# Altium schematic sheet MB1137.SchDoc: TOP & POWER
size A4; DocumentNumber: MB1137; Revision: B-01; SheetNumber: 1; SheetTotal: 6; Project: NUCLEO-XXXXZX
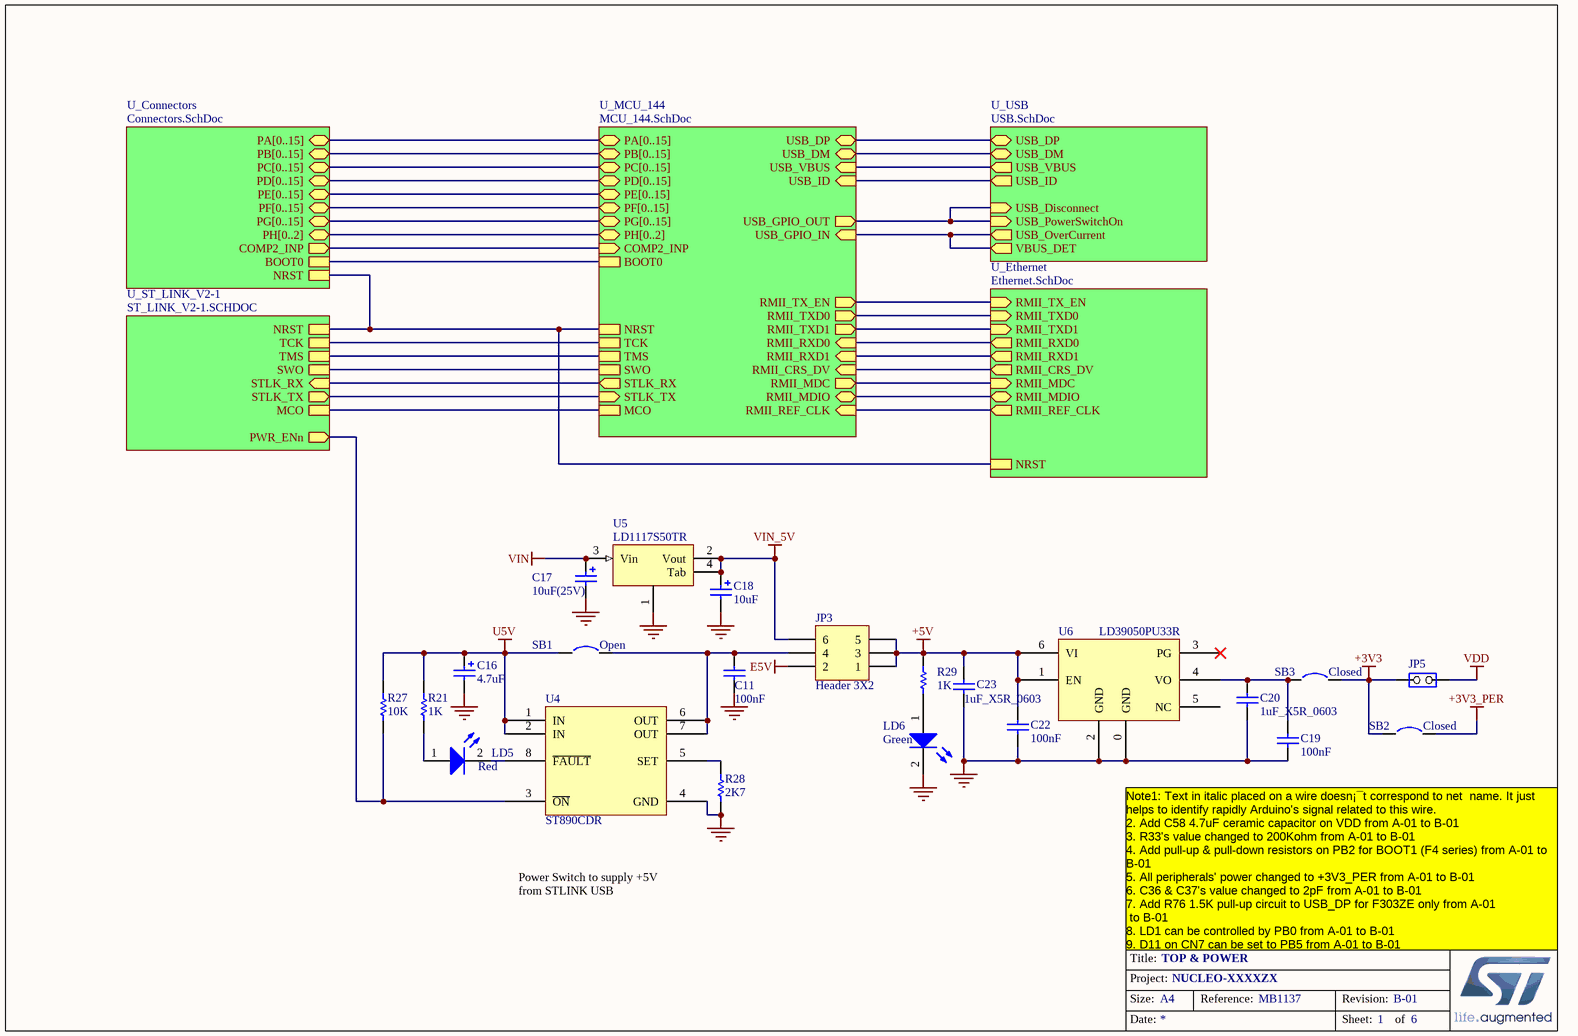
[diagram p0: MB1137.SchDoc]

## Parts
C11  100nF  [0603C]
C16  4.7uF  [TAN-A]
C17  10uF(25V)  [TAN-B]
C18  10uF  [TAN-A]
C19  100nF  [0603C]
C20  1uF_X5R_0603  [0603C]
C22  100nF  [0603C]
C23  1uF_X5R_0603  [0603C]
JP3  Header 3X2  [HDR_3x2_2R54_V_M]
JP5  (no value)  [HDR_1x2_2R54_V_M_S]
LD5  Red  [0603D-R]
LD6  Green  [0603D-G]
R21  1K  [0603R]
R27  10K  [0603R]
R28  2K7  [0603R]
R29  1K  [0603R]
SB1  Open  [SB_0603]
SB2  Closed  [SB_0603]
SB3  Closed  [SB_0603]
U4  ST890CDR  [SOIC8_1R27_4R9X6]
U5  LD1117S50TR  [SOT-223]
U6  LD39050PU33R  [DFN6_0R95_3x3_TP]

## Sub-sheets
U_Connectors = Connectors.SchDoc: PA[0..15] (bidir), PB[0..15] (bidir), PC[0..15] (bidir), NRST, BOOT0, PD[0..15] (bidir), PE[0..15] (bidir), PF[0..15] (bidir), PG[0..15] (bidir), PH[0..2] (bidir), COMP2_INP (out)
U_Ethernet = Ethernet.SchDoc: RMII_TXD0 (in), RMII_TX_EN (in), RMII_RXD0 (out), RMII_REF_CLK (out), RMII_CRS_DV (out), RMII_MDC (in), RMII_MDIO (bidir), NRST, RMII_TXD1 (in), RMII_RXD1 (out)
U_MCU_144 = MCU_144.SchDoc: NRST, MCO, STLK_TX (in), STLK_RX (out), PA[0..15] (bidir), PB[0..15] (bidir), PC[0..15] (bidir), TCK, TMS, SWO, BOOT0, PD[0..15] (bidir), PE[0..15] (bidir), PF[0..15] (bidir), PG[0..15] (bidir), PH[0..2] (bidir), USB_DM (bidir), USB_DP (bidir), USB_GPIO_OUT (out), USB_GPIO_IN (in), USB_ID (in), USB_VBUS (in), RMII_TXD0 (out), RMII_TX_EN (out), RMII_RXD0 (in), RMII_REF_CLK (in), RMII_CRS_DV (in), RMII_MDC (out), RMII_MDIO (bidir), RMII_TXD1 (out), RMII_RXD1 (in), COMP2_INP (in)
U_ST_LINK_V2-1 = ST_LINK_V2-1.SCHDOC: TMS, TCK, MCO, NRST, STLK_RX (in), STLK_TX (out), SWO, PWR_ENn (out)
U_USB = USB.SchDoc: USB_PowerSwitchOn (in), USB_OverCurrent (out), USB_DM (bidir), USB_DP (bidir), USB_ID (out), USB_VBUS (out), USB_Disconnect (in), VBUS_DET (out)

## Nets
+3V3: JP5.1(COMMON) SB2.1 SB3.2
+3V3_PER: SB2.2
+5V: C22.2 C23.1 JP3.1 JP3.3 JP3.5 R29.2 U6.1(EN) U6.6(VI)
E5V: JP3.2
GND: C11.1 C16.2 C17.2 C18.2 C19.1 C20.2 C22.1 C23.2 LD6.2(K) R28.1 U4.4(GND) U5.1 U6.0(GND) U6.2(GND)
U5V: C16.1 R21.1 R27.1 SB1.1 U4.1(IN) U4.2(IN)
VDD: JP5.2(NO)
VIN: C17.1 U5.3(Vin)
VIN_5V: C18.1 JP3.6 U5.2(Vout) U5.4(Tab)
NetC11_2: C11.2 JP3.4 SB1.2 U4.6(OUT) U4.7(OUT)
NetC19_2: C19.2 C20.1 SB3.1 U6.4(VO)
NetLD5_1: LD5.1(A) R21.2
NetLD5_2: LD5.2(K) U4.8(~{FAULT})
NetLD6_1: LD6.1(A) R29.1
NetR27_2: R27.2 U4.3(~{ON}) ; sheet U_ST_LINK_V2-1/PWR_ENn
NetR28_2: R28.2 U4.5(SET)
(unnamed): sheet U_Connectors/NRST, sheet U_ST_LINK_V2-1/NRST, sheet U_Ethernet/NRST, sheet U_MCU_144/NRST
(unnamed): sheet U_Connectors/BOOT0, sheet U_MCU_144/BOOT0
(unnamed): sheet U_Connectors/COMP2_INP, sheet U_MCU_144/COMP2_INP
(unnamed): sheet U_ST_LINK_V2-1/TMS, sheet U_MCU_144/TMS
(unnamed): sheet U_ST_LINK_V2-1/TCK, sheet U_MCU_144/TCK
(unnamed): sheet U_ST_LINK_V2-1/MCO, sheet U_MCU_144/MCO
(unnamed): sheet U_ST_LINK_V2-1/STLK_RX, sheet U_MCU_144/STLK_RX
(unnamed): sheet U_ST_LINK_V2-1/STLK_TX, sheet U_MCU_144/STLK_TX
(unnamed): sheet U_ST_LINK_V2-1/SWO, sheet U_MCU_144/SWO
(unnamed): sheet U_Ethernet/RMII_TXD0, sheet U_MCU_144/RMII_TXD0
(unnamed): sheet U_Ethernet/RMII_TX_EN, sheet U_MCU_144/RMII_TX_EN
(unnamed): sheet U_Ethernet/RMII_RXD0, sheet U_MCU_144/RMII_RXD0
(unnamed): sheet U_Ethernet/RMII_REF_CLK, sheet U_MCU_144/RMII_REF_CLK
(unnamed): sheet U_Ethernet/RMII_CRS_DV, sheet U_MCU_144/RMII_CRS_DV
(unnamed): sheet U_Ethernet/RMII_MDC, sheet U_MCU_144/RMII_MDC
(unnamed): sheet U_Ethernet/RMII_MDIO, sheet U_MCU_144/RMII_MDIO
(unnamed): sheet U_Ethernet/RMII_TXD1, sheet U_MCU_144/RMII_TXD1
(unnamed): sheet U_Ethernet/RMII_RXD1, sheet U_MCU_144/RMII_RXD1
(unnamed): sheet U_MCU_144/USB_DM, sheet U_USB/USB_DM
(unnamed): sheet U_MCU_144/USB_DP, sheet U_USB/USB_DP
(unnamed): sheet U_MCU_144/USB_GPIO_OUT, sheet U_USB/USB_PowerSwitchOn, sheet U_USB/USB_Disconnect
(unnamed): sheet U_MCU_144/USB_GPIO_IN, sheet U_USB/USB_OverCurrent, sheet U_USB/VBUS_DET
(unnamed): sheet U_MCU_144/USB_ID, sheet U_USB/USB_ID
(unnamed): sheet U_MCU_144/USB_VBUS, sheet U_USB/USB_VBUS

Not connected (* = marked no-connect by the designer): U6 3(PG)* 5(NC)

## Buses and harness runs
bus sheet U_Connectors/PA[0..15] = sheet U_MCU_144/PA[0..15]
bus sheet U_Connectors/PB[0..15] = sheet U_MCU_144/PB[0..15]
bus sheet U_Connectors/PC[0..15] = sheet U_MCU_144/PC[0..15]
bus sheet U_Connectors/PD[0..15] = sheet U_MCU_144/PD[0..15]
bus sheet U_Connectors/PE[0..15] = sheet U_MCU_144/PE[0..15]
bus sheet U_Connectors/PF[0..15] = sheet U_MCU_144/PF[0..15]
bus sheet U_Connectors/PG[0..15] = sheet U_MCU_144/PG[0..15]
bus sheet U_Connectors/PH[0..2] = sheet U_MCU_144/PH[0..2]

## Notes on the sheet
- Power Switch to supply +5V from STLINK USB
- Note1: Text in italic placed on a wire doesn¡¯t correspond to net  name. It just helps to identify rapidly Arduino's signal related to this wire.
  2. Add C58 4.7uF ceramic capacitor on VDD from A-01 to B-01
  3. R33's value changed to 200Kohm from A-01 to B-01
  4. Add pull-up & pull-down resistors on PB2 for BOOT1 (F4 series) from A-01 to B-01
  5. All peripherals' power changed to +3V3_PER from A-01 to B-01
  6. C36 & C37's value changed to 2pF from A-01 to B-01
  7. Add R76 1.5K pull-up circuit to USB_DP for F303ZE only from A-01
  to B-01
  8. LD1 can be controlled by PB0 from A-01 to B-01
  9. D11 on CN7 can be set to PB5 from A-01 to B-01
- Title:
- Project:
- Size:
- Date:
- A4
- Reference:
- Sheet:
- Revision:
- of

## Library data of the parts
C11 C19 C22 = Capacitor_ST: Capacitor 0402 / 0603 / 0805; Revision: July-2002: Re-released for DXP Platform.; Value: 100nF
C16 = Cap Pol1: Polarized Capacitor (Radial); Value: 100pF; Ordered by: Subcon; Published: 8-Jun-2000; Revision: July-2002: Re-released for DXP Platform.; Publisher: Altium Limited
C17 C18 = Cap Pol1: Polarized Capacitor (Radial); Published: 8-Jun-2000; Revision: July-2002: Re-released for DXP Platform.; Publisher: Altium Limited; Value: 10uF
C20 C23 = CAP SMD 0603  X5R 1µF 25V 10%: 0603  X5R 1µF; Rated voltage: 25V; Tolerance: 10%; Manufacturer: *; Manufacturer P/N: *; Order code Farnell: 1288202RL; Value: 1µF; Power: *; Technology: X5R; Temperature  Factor: *; Temperature Max: +125°C; Temperature Min: -55°C; STS Code: *
JP3 = Header 3X2: Header, 3-Pin, Dual row; Revision: 17-Jul-2002: Re-released for DXP Platform.; Publisher: Altium Limited
JP5 = JP2
LD5 LD6 = LED2: Typical RED, GREEN, YELLOW, AMBER GaAs LED; Published: 8-Jun-2000; Revision: July-2002: Re-released for DXP Platform.; Publisher: Altium Limited
R21 = Res1: Resistor; Ordered by: Subcon; Published: 8-Jun-2000; Revision: July-2002: Re-released for DXP Platform.; Publisher: Altium Limited; Value: 1K
R27 = Resistor_ST: Resistor 0402 / 0603 / 0805; Value: 10K
R28 R29 = Resistor_ST: Resistor 0402 / 0603 / 0805; Value: 10K
SB1 = Circuit Breaker: Published: 24-Mar-1999; Revision: July-2002: Re-released for DXP Platform.; Publisher: Altium Limited
SB2 SB3 = Circuit Breaker_close: Circuit Breaker; Published: 24-Mar-1999; Revision: July-2002: Re-released for DXP Platform.; Publisher: Altium Limited
U5 = LD1117
U6 = LD39050P